# EAGLE design lupa300v3 (EAGLE 8.7.0)
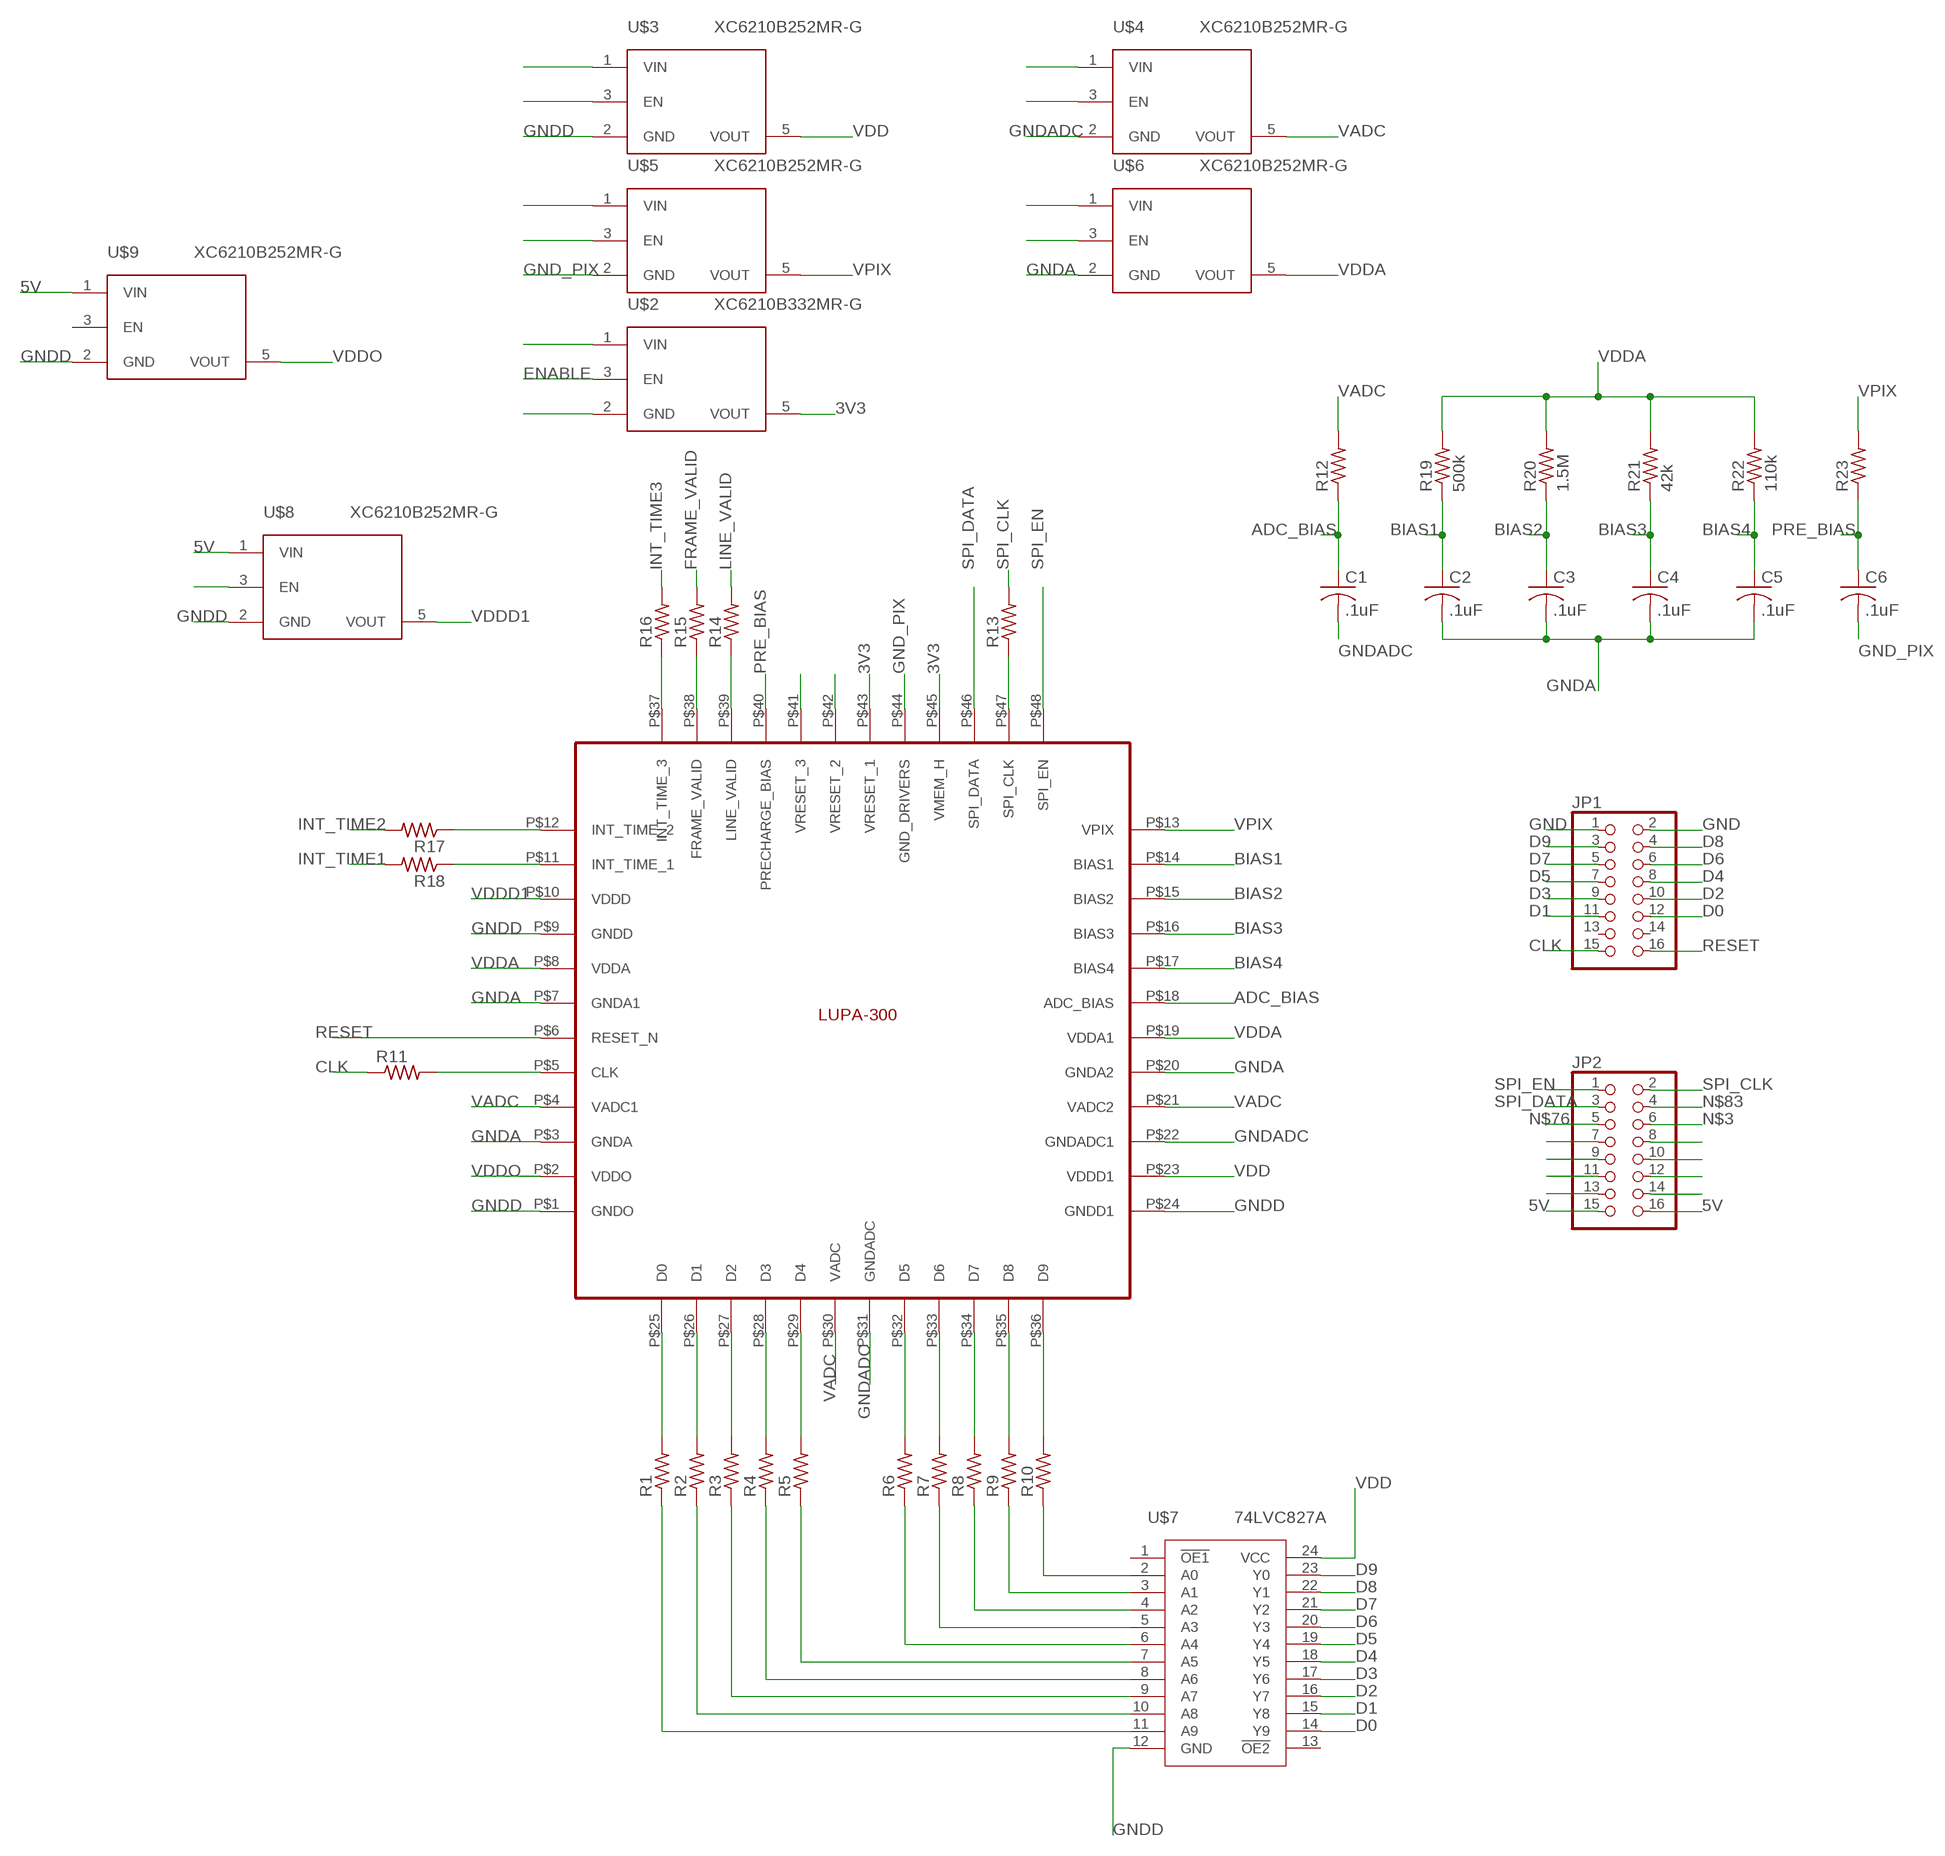
[diagram p0: schematic, sheet 1]

## Parts
C1  .1uF  C-USC0603K  [C0603K]
C2  .1uF  C-USC0603K  [C0603K]
C3  .1uF  C-USC0603K  [C0603K]
C4  .1uF  C-USC0603K  [C0603K]
C5  .1uF  C-USC0603K  [C0603K]
C6  .1uF  C-USC0603K  [C0603K]
JP1  PINHD-2X8  [2X08]
JP2  PINHD-2X8  [2X08]
R1  R-US_R0603  [R0603]
R2  R-US_R0603  [R0603]
R3  R-US_R0603  [R0603]
R4  R-US_R0603  [R0603]
R5  R-US_R0603  [R0603]
R6  R-US_R0603  [R0603]
R7  R-US_R0603  [R0603]
R8  R-US_R0603  [R0603]
R9  R-US_R0603  [R0603]
R10  R-US_R0603  [R0603]
R11  R-US_R0603  [R0603]
R12  R-US_R0603  [R0603]
R13  R-US_R0603  [R0603]
R14  R-US_R0603  [R0603]
R15  R-US_R0603  [R0603]
R16  R-US_R0603  [R0603]
R17  R-US_R0603  [R0603]
R18  R-US_R0603  [R0603]
R19  500k  R-US_R0603  [R0603]
R20  1.5M  R-US_R0603  [R0603]
R21  42k  R-US_R0603  [R0603]
R22  110k  R-US_R0603  [R0603]
R23  R-US_R0603  [R0603]
U$1  LUPA300  [LUPA300]
U$2  XC6210B332MR-G  [SOT25]
U$3  XC6210B252MR-G  [SOT25]
U$4  XC6210B252MR-G  [SOT25]
U$5  XC6210B252MR-G  [SOT25]
U$6  XC6210B252MR-G  [SOT25]
U$7  74LVC827A  [TSSOP24]
U$8  XC6210B252MR-G  [SOT25]
U$9  XC6210B252MR-G  [SOT25]

## Nets
3V3: U$1.P$43(VRESET_1) U$1.P$45(VMEM_H) U$2.5(VOUT)
5V: JP2.15 JP2.16 U$2.1(VIN) U$3.1(VIN) U$4.1(VIN) U$5.1(VIN) U$6.1(VIN) U$8.1(VIN) U$9.1(VIN)
ADC_BIAS: C1.1 R12.1 U$1.P$18(ADC_BIAS)
BIAS1: C2.1 R19.1 U$1.P$14(BIAS1)
BIAS2: C3.1 R20.1 U$1.P$15(BIAS2)
BIAS3: C4.1 R21.1 U$1.P$16(BIAS3)
BIAS4: C5.1 R22.1 U$1.P$17(BIAS4)
CLK: JP1.15 R11.1
D0: JP1.12 U$7.14(Y9)
D1: JP1.11 U$7.15(Y8)
D2: JP1.10 U$7.16(Y7)
D3: JP1.9 U$7.17(Y6)
D4: JP1.8 U$7.18(Y5)
D5: JP1.7 U$7.19(Y4)
D6: JP1.6 U$7.20(Y3)
D7: JP1.5 U$7.21(Y2)
D8: JP1.4 U$7.22(Y1)
D9: JP1.3 U$7.23(Y0)
ENABLE: U$2.3(EN) U$3.3(EN) U$4.3(EN) U$5.3(EN) U$6.3(EN)
FRAME_VALID: R15.2
GND: JP1.1 JP1.2
GND_PIX: C6.2 U$1.P$44(GND_DRIVERS) U$5.2(GND)
GNDA: C2.2 C3.2 C4.2 C5.2 U$1.P$3(GNDA) U$1.P$7(GNDA1) U$1.P$20(GNDA2) U$6.2(GND)
GNDADC: C1.2 U$1.P$22(GNDADC1) U$1.P$31(GNDADC) U$4.2(GND)
GNDD: U$1.P$1(GNDO) U$1.P$9(GNDD) U$1.P$24(GNDD1) U$3.2(GND) U$7.12(GND) U$8.2(GND) U$9.2(GND)
INT1: R18.1 U$1.P$11(INT_TIME_1)
INT2: R17.1 U$1.P$12(INT_TIME_2)
INT_TIME1: R18.2
INT_TIME2: R17.2
INT_TIME3: R16.2
LINE_VALID: R14.2
N$1: R1.2 U$1.P$25(D0)
N$2: R2.2 U$1.P$26(D1)
N$3: JP2.6
N$4: JP2.7
N$5: R3.2 U$1.P$27(D2)
N$6: JP2.8
N$7: JP2.10
N$8: JP2.12
N$9: R4.2 U$1.P$28(D3)
N$10: JP2.14
N$11: JP2.13
N$12: JP2.11
N$13: R5.2 U$1.P$29(D4)
N$14: R6.2 U$1.P$32(D5)
N$15: R7.2 U$1.P$33(D6)
N$16: R8.2 U$1.P$34(D7)
N$17: R9.2 U$1.P$35(D8)
N$18: R10.2 U$1.P$36(D9)
N$19: R11.2 U$1.P$5(CLK)
N$20: JP2.9
N$21: R13.1 U$1.P$47(SPI_CLK)
N$23: R14.1 U$1.P$39(LINE_VALID)
N$24: R15.1 U$1.P$38(FRAME_VALID)
N$25: R16.1 U$1.P$37(INT_TIME_3)
N$26: R10.1 U$7.2(A0)
N$27: U$1.P$41(VRESET_3)
N$28: U$1.P$42(VRESET_2)
N$29: U$2.2(GND)
N$31: R9.1 U$7.3(A1)
N$32: R8.1 U$7.4(A2)
N$33: R7.1 U$7.5(A3)
N$34: R6.1 U$7.6(A4)
N$35: R5.1 U$7.7(A5)
N$36: R4.1 U$7.8(A6)
N$37: R3.1 U$7.9(A7)
N$38: R2.1 U$7.10(A8)
N$39: R1.1 U$7.11(A9)
N$40: U$8.3(EN)
N$76: JP2.5
N$83: JP2.4
PRE_BIAS: C6.1 R23.1 U$1.P$40(PRECHARGE_BIAS)
RESET: JP1.16 U$1.P$6(RESET_N)
SPI_CLK: JP2.2 R13.2
SPI_DATA: JP2.3 U$1.P$46(SPI_DATA)
SPI_EN: JP2.1 U$1.P$48(SPI_EN)
VADC: R12.2 U$1.P$4(VADC1) U$1.P$21(VADC2) U$1.P$30(VADC) U$4.5(VOUT)
VDD: U$1.P$23(VDDD1) U$3.5(VOUT) U$7.24(VCC)
VDDA: R19.2 R20.2 R21.2 R22.2 U$1.P$8(VDDA) U$1.P$19(VDDA1) U$6.5(VOUT)
VDDD1: U$1.P$10(VDDD) U$8.5(VOUT)
VDDO: U$1.P$2(VDDO) U$9.5(VOUT)
VPIX: R23.2 U$1.P$13(VPIX) U$5.5(VOUT)
Unconnected: JP1.13 JP1.14 U$7.1(!OE1) U$7.13(!OE2) U$9.3(EN)

## Library data of the parts
C1-C6 = rcl:C-US: CAPACITOR, American symbol; SPICEPREFIX: C
JP1 JP2 = pinhead:PINHD-2X8: PIN HEADER
R1-R23 = rcl:R-US_: RESISTOR, American symbol; SPICEPREFIX: R
U$1 = andon:LUPA300
U$2 = lupa300-components:XC6210B332MR-G: Linear Voltage Regulator IC Positive Fixed 1 Output 3.3V 700mA SOT-25
U$3-U$6 U$8 U$9 = lupa300-components:XC6210B252MR-G: Linear Voltage Regulator IC Positive Fixed 1 Output 2.5V 700mA SOT-25
U$7 = lupa300-components:74LVC827A: Buffer, Non-Inverting 1 Element 10 Bit per Element Push-Pull Output 24-TSSOP

## Board
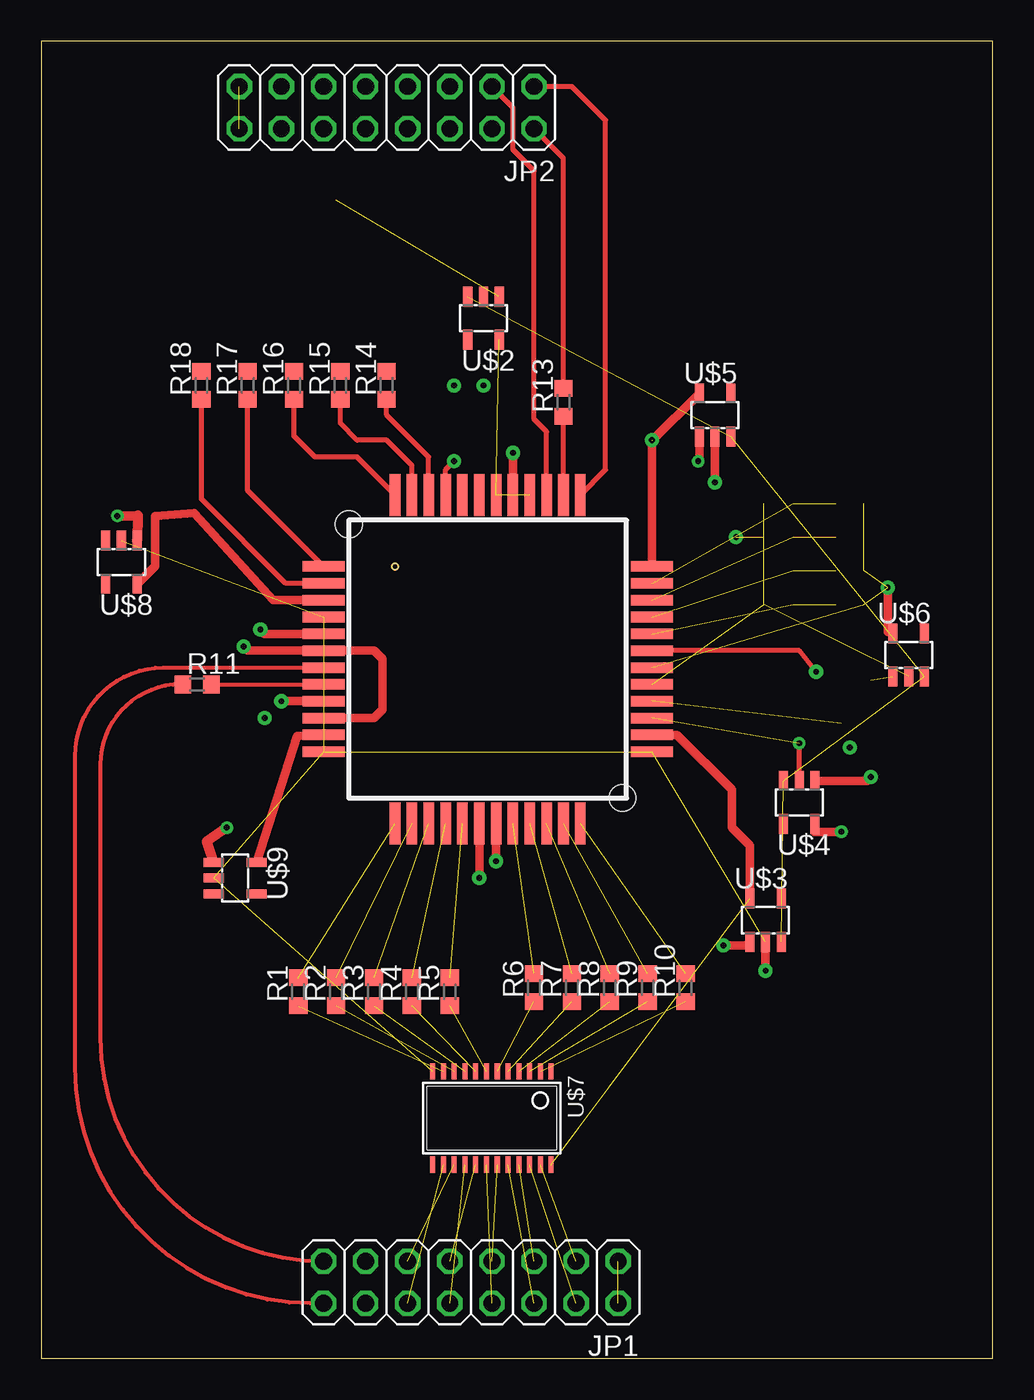
[diagram p1: board, top side]
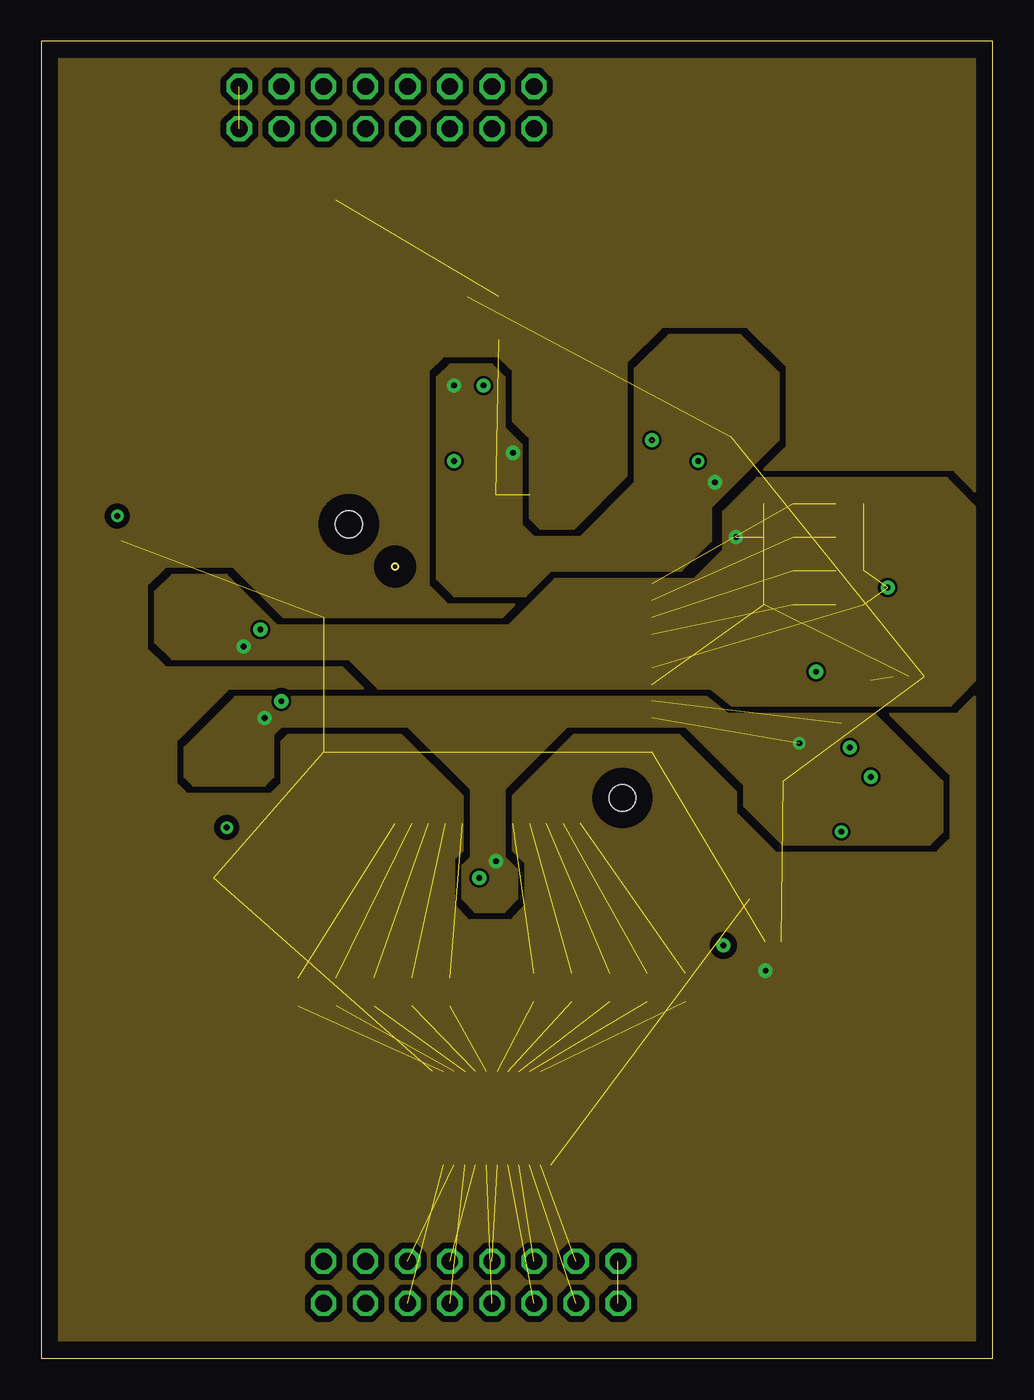
[diagram p2: board, inner layer Route2]
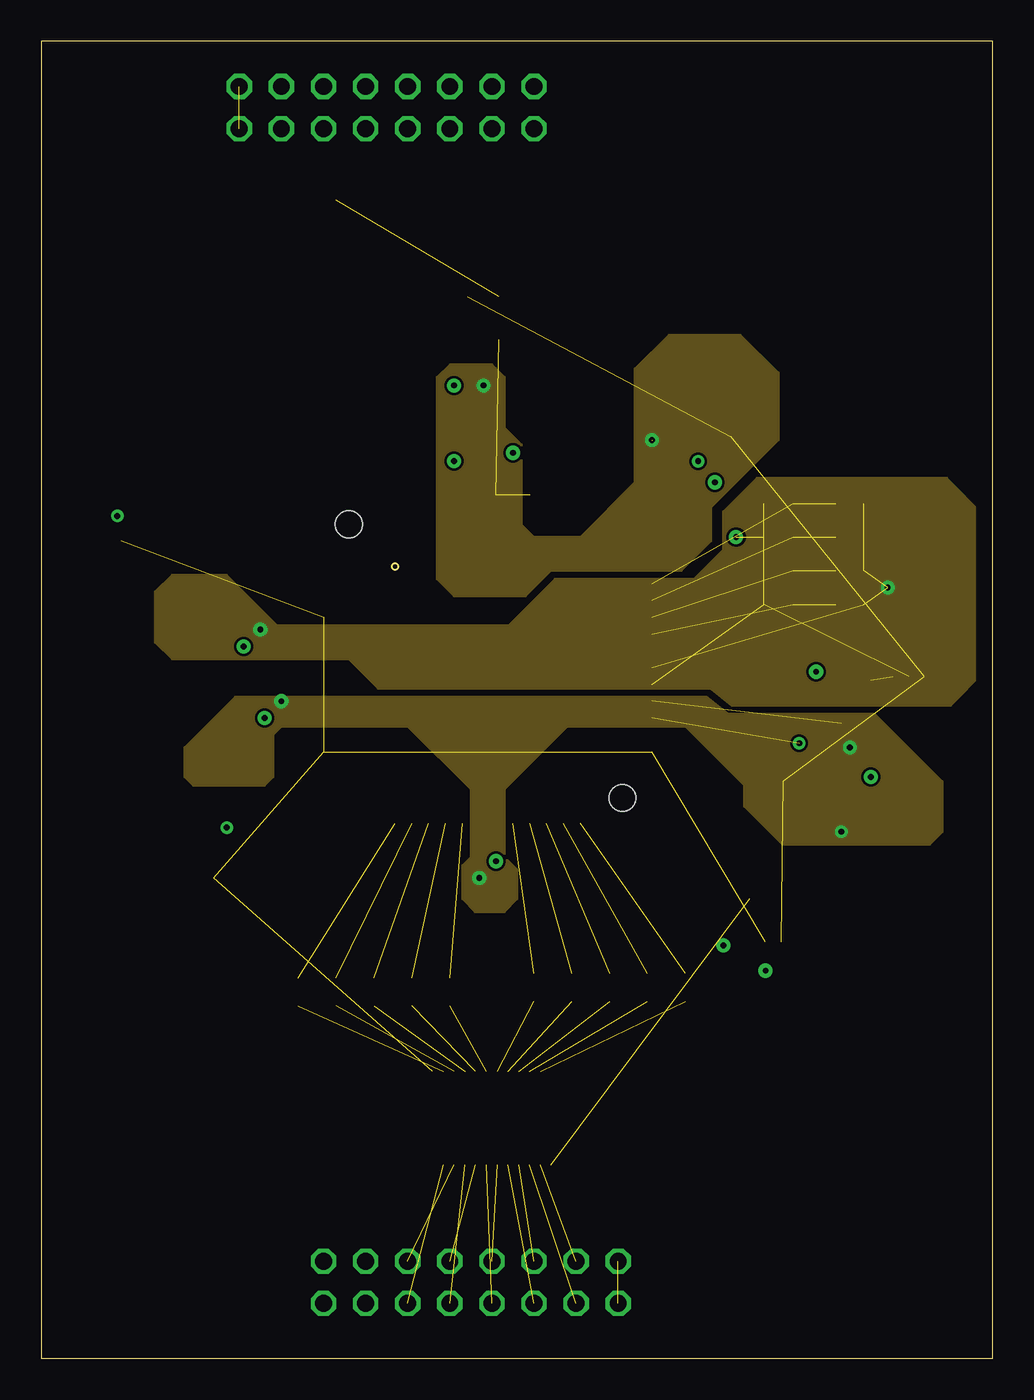
[diagram p3: board, inner layer Route15]
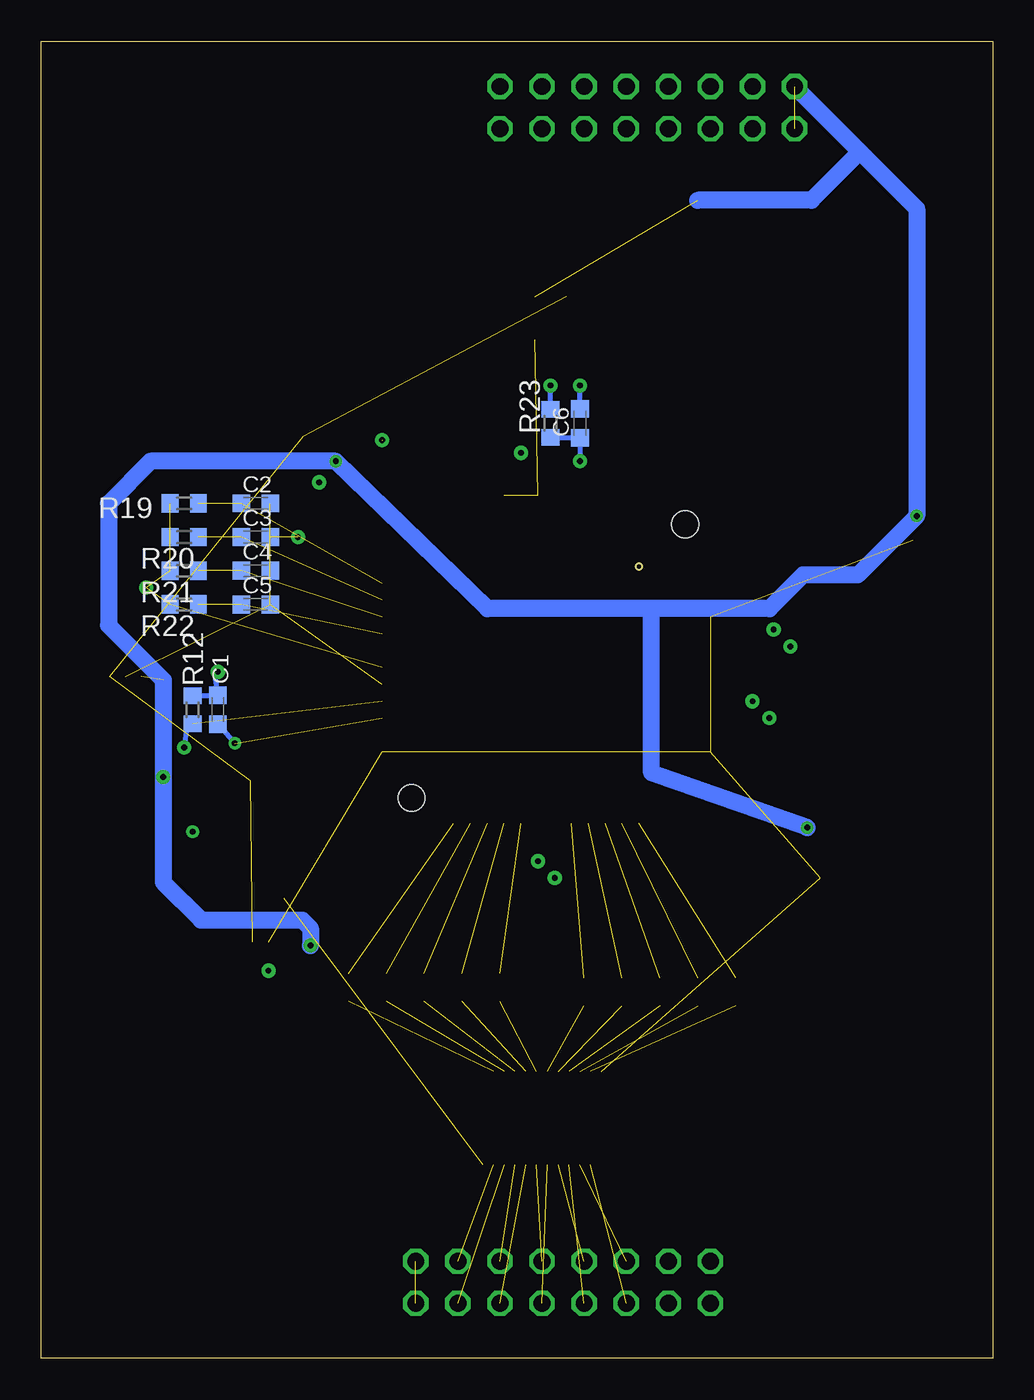
[diagram p4: board, bottom side, seen from below]

Size 57.38 x 79.43 mm. Coordinates in mm from the lower left corner, seen from the top.
Outline: 0,0 57.38,0 57.38,79.43 0,79.43 0,0
Copper layers (1+2*15+16): Top 0.035mm / dielectric 1.5mm / Route2 0.035mm / dielectric 0.15mm / Route15 0.035mm / dielectric 0.2mm / Bottom 0.035mm
Design rules "default *": minimum track width 6mil, minimum drill 0.35mm, track to track 6mil, track to pad 6mil, pad to pad 6mil, via to via 6mil, smd to smd 6mil, copper to edge 40mil, drill to drill 6mil, minimum pad ring 10mil, minimum via ring 8mil, stop-mask expansion 4mil, vias tented up to drill 0mil, thermal gap 10mil

### Footprints (pad centres in the part's own frame; a part is rotated, then mirrored left to right if it is on the bottom)
C0603K = smd 1.05 x 1.08: 1 -0.875,0; 2 0.875,0
2X08 = drill 1.016 octagon: 1 -8.89,-1.27; 2 -8.89,1.27; 3 -6.35,-1.27; 4 -6.35,1.27; 5 -3.81,-1.27; 6 -3.81,1.27; 7 -1.27,-1.27; 8 -1.27,1.27; 9 1.27,-1.27; 10 1.27,1.27; 11 3.81,-1.27; 12 3.81,1.27; 13 6.35,-1.27; 14 6.35,1.27; 15 8.89,-1.27; 16 8.89,1.27
R0603 = smd 1 x 1.1: 1 -0.85,0; 2 0.85,0
LUPA300 = smd 2.54 x 0.635: P$1 -2.794,1.524; P$2 -2.794,2.54; P$3 -2.794,3.556; P$4 -2.794,4.572; P$5 -2.794,5.588; P$6 -2.794,6.604; P$7 -2.794,7.62; P$8 -2.794,8.636; P$9 -2.794,9.652; P$10 -2.794,10.668; P$11 -2.794,11.684; P$12 -2.794,12.7; P$13 17.018,12.7; P$14 17.018,11.684; P$15 17.018,10.668; P$16 17.018,9.652; P$17 17.018,8.636; P$18 17.018,7.62; P$19 17.018,6.604; P$20 17.018,5.588; P$21 17.018,4.572; P$22 17.018,3.556; P$23 17.018,2.54; P$24 17.018,1.524 | smd 0.635 x 2.54: P$25 1.524,-2.794; P$26 2.54,-2.794; P$27 3.556,-2.794; P$28 4.572,-2.794; P$29 5.588,-2.794; P$30 6.604,-2.794; P$31 7.62,-2.794; P$32 8.636,-2.794; P$33 9.652,-2.794; P$34 10.668,-2.794; P$35 11.684,-2.794; P$36 12.7,-2.794; P$37 1.524,17.018; P$38 2.54,17.018; P$39 3.556,17.018; P$40 4.572,17.018; P$41 5.588,17.018; P$42 6.604,17.018; P$43 7.62,17.018; P$44 8.636,17.018; P$45 9.652,17.018; P$46 10.668,17.018; P$47 11.684,17.018; P$48 12.7,17.018 | hole 1.6: -1.27,15.24; 15.24,-1.27
SOT25 = smd 0.55 x 1.2: 1 -0.95,-1.3; 2 0,-1.3; 3 0.95,-1.3; 4 0.95,1.3; 5 -0.95,1.3
TSSOP24 = smd 0.305 x 0.991: 1 -3.575,-2.818; 2 -2.925,-2.818; 3 -2.275,-2.818; 4 -1.625,-2.818; 5 -0.975,-2.818; 6 -0.325,-2.818; 7 0.325,-2.818; 8 0.975,-2.818; 9 1.625,-2.818; 10 2.275,-2.818; 11 2.925,-2.818; 12 3.575,-2.818; 13 3.575,2.818; 14 2.925,2.818; 15 2.275,2.818; 16 1.625,2.818; 17 0.975,2.818; 18 0.325,2.818; 19 -0.325,2.818; 20 -0.975,2.818; 21 -1.625,2.818; 22 -2.275,2.818; 23 -2.925,2.818; 24 -3.575,2.818

### Placement (x,y rotation side)
C1  46.74,39.12 270 bottom
C2  44.45,51.56 0 bottom
C3  44.45,49.53 0 bottom
C4  44.45,47.5 0 bottom
C5  44.45,45.47 0 bottom
C6  24.89,56.39 90 bottom
JP1  25.91,4.57 180 top
JP2  20.83,75.44 180 top
R1  15.49,22.1 90 top
R2  17.78,22.1 90 top
R3  20.07,22.1 90 top
R4  22.35,22.1 90 top
R5  24.64,22.1 90 top
R6  29.72,22.35 90 top
R7  32,22.35 90 top
R8  34.29,22.35 90 top
R9  36.58,22.35 90 top
R10  38.86,22.35 90 top
R11  9.4,40.64 0 top
R12  48.26,39.12 270 bottom
R13  31.5,57.66 90 top
R14  20.83,58.67 90 top
R15  18.03,58.67 90 top
R16  15.24,58.67 90 top
R17  12.45,58.67 90 top
R18  9.65,58.67 90 top
R19  48.77,51.56 180 bottom
R20  48.77,49.53 180 bottom
R21  48.77,47.5 180 bottom
R22  48.77,45.47 180 bottom
R23  26.67,56.39 90 bottom
U$1  19.81,35.05 0 top
U$2  26.67,62.74 180 top
U$3  43.69,26.42 0 top
U$4  45.72,33.53 180 top
U$5  40.64,56.9 0 top
U$6  52.32,42.42 0 top
U$7  27.18,14.48 180 top
U$8  4.83,48.01 180 top
U$9  11.68,28.96 270 top

### Tracks (layer width: path | path; a pad name or v marks a point on that pad's centre or on a via)
3V3  (2 unrouted)
5V  (via drill 0.35, 0.35 pad 0.85)  (3 unrouted)
  Top 0.508: U$4.1 49.81,34.83 v50.04,35.05 | U$5.1 39.69,54.17 v39.62,54.1 | v41.15,24.89 42.51,24.89 U$3.1
  Top 0.61: v4.57,50.8 5.81,50.83 U$8.1 | v11.18,32 9.97,31.18 U$9.1
  Bottom 1.016: JP2.15 8,72.77 | 8,72.77 4.57,69.34 v4.57,50.8 8.13,47.24 11.43,47.24 13.46,45.21 20.32,45.21 | v11.18,32 20.57,35.31 20.57,44.96 20.32,45.21 | 20.32,45.21 30.48,45.21 v39.62,54.1 50.8,54.1 53.34,51.56 53.34,44.2 50.04,40.89 v50.04,35.05 50.04,28.7 47.75,26.42 41.66,26.42 41.15,25.91 v41.15,24.89 | 8,72.77 10.92,69.85 17.78,69.85
ADC_BIAS  (via drill 0.35 pad 0.85)
  Top 0.305: v46.74,41.4 45.72,42.67 U$1.P$18
  Bottom 0.305: R12.1 46.51,39.97 C1.1 46.88,41.01 v46.74,41.4
BIAS1  (2 unrouted)
BIAS2  (2 unrouted)
BIAS3  (2 unrouted)
BIAS4  (2 unrouted)
CLK
  Top 0.254: R11.1 8.38,40.64 arc90 3.56,35.81 3.56,19.3 arc90 JP1.15
D0  (1 unrouted)
D1  (1 unrouted)
D2  (1 unrouted)
D3  (1 unrouted)
D4  (1 unrouted)
D5  (1 unrouted)
D6  (1 unrouted)
D7  (1 unrouted)
D8  (1 unrouted)
D9  (1 unrouted)
ENABLE  (4 unrouted)
GND  (1 unrouted)
GND_PIX  (via drill 0.35 pad 0.85)
  Top 0.508: v40.64,52.83 U$5.2 | v28.45,54.61 U$1.P$44
  Bottom 0.305: C6.2 v24.89,58.67
  pour Route2: 23.88,59.18 23.88,46.99 24.89,45.97 29.21,45.97 30.73,47.5 38.61,47.5 40.39,49.28 40.39,51.31 44.45,55.37 44.45,59.44 42.16,61.72 37.85,61.72 35.81,59.69 35.81,52.83 32.51,49.53 29.72,49.53 28.96,50.29 28.96,55.12 27.94,56.13 27.94,59.18 27.18,59.94 24.64,59.94
GNDA  (via drill 0.35 pad 0.85)  (6 unrouted)
  Top 0.508: v12.19,42.93 12.45,42.67 U$1.P$7 20.07,42.67 20.57,42.16 20.57,39.12 20.07,38.61 U$1.P$3
  other vias: 41.91,49.53
  pour Route2: 7.87,42.16 18.54,42.16 20.32,40.39 40.39,40.39 41.66,39.37 54.86,39.37 56.9,41.4 56.9,50.8 54.61,53.09 43.18,53.09 41.15,51.05 41.15,48.77 39.37,46.99 30.99,46.99 28.19,44.2 14.22,44.2 11.18,47.24 7.87,47.24 6.86,46.23 6.86,43.18
GNDADC  (via drill 0.35, 0.35 pad 0.85)  (1 unrouted)
  Top 0.305: U$4.2 v45.72,37.08
  Top 0.508: v27.43,29.97 U$1.P$31
  Bottom 0.305: C1.2 v45.72,37.08
  other vias: 13.46,38.61
  pour Route2: 25.91,30.23 25.91,34.29 22.1,38.1 14.48,38.1 13.97,37.59 13.97,35.05 13.46,34.54 9.14,34.54 8.64,35.05 8.64,36.83 11.68,39.88 40.13,39.88 41.4,38.86 50.29,38.86 54.36,34.8 54.36,31.75 53.59,30.99 44.7,30.99 42.42,33.27 42.42,34.54 38.86,38.1 31.75,38.1 27.94,34.29 27.94,30.23 28.7,29.46 28.7,27.69 27.94,26.92 26.16,26.92 25.4,27.69 25.4,29.72
GNDD  (via drill 0.35 pad 0.85)  (6 unrouted)
  Top 0.508: v43.69,23.37 U$3.2
  pour Route2 (isolate 0.381, rank 2): 0,78.99 57.15,78.99 57.15,0 0.25,0 0,-0.25
INT1
  Top 0.305: U$1.P$11 14.73,46.74 9.65,51.82 R18.1
INT2
  Top 0.305: U$1.P$12 12.45,52.32 R17.1
N$1  (1 unrouted)
N$2  (1 unrouted)
N$5  (1 unrouted)
N$9  (1 unrouted)
N$13  (1 unrouted)
N$14  (1 unrouted)
N$15  (1 unrouted)
N$16  (1 unrouted)
N$17  (1 unrouted)
N$18  (1 unrouted)
N$19
  Top 0.254: R11.2 U$1.P$5
N$21
  Top 0.305: U$1.P$47 R13.1
N$23
  Top 0.305: U$1.P$39 23.37,54.36 20.83,56.9 R14.1
N$24
  Top 0.305: U$1.P$38 22.35,53.85 20.83,55.37 19.05,55.37 18.03,56.39 R15.1
N$25
  Top 0.305: U$1.P$37 19.05,54.36 16.51,54.36 15.24,55.63 R16.1
N$26  (1 unrouted)
N$31  (1 unrouted)
N$32  (1 unrouted)
N$33  (1 unrouted)
N$34  (1 unrouted)
N$35  (1 unrouted)
N$36  (1 unrouted)
N$37  (1 unrouted)
N$38  (1 unrouted)
N$39  (1 unrouted)
PRE_BIAS  (via drill 0.35 pad 0.85)
  Top 0.305: U$1.P$40 24.38,53.59 v24.89,54.1
  Bottom 0.305: R23.1 26.64,55.51 C6.1 v24.89,54.1
RESET
  Top 0.254: JP1.16 16.26,3.3 arc-90 2.03,17.53 2.03,36.32 arc-90 7.37,41.66 U$1.P$6
SPI_CLK
  Top 0.305: R13.2 31.5,72.39 JP2.2
SPI_DATA
  Top 0.305: U$1.P$46 30.48,55.88 29.72,56.64 29.72,71.63 28.45,72.9 28.45,75.44 JP2.3
SPI_EN
  Top 0.305: U$1.P$48 34.04,53.59 34.04,74.68 32,76.71 JP2.1
VADC  (via drill 0.35, 0.35 pad 0.85)  (1 unrouted)
  Top 0.508: U$4.5 46.64,31.75 v48.26,31.75 | v14.48,39.62 U$1.P$4 | U$1.P$30 v26.42,28.96
  Bottom 0.305: R12.2 48.6,38.27 v48.77,36.83
  pour Route15: 25.91,30.23 25.91,34.29 22.1,38.1 14.48,38.1 13.97,37.59 13.97,35.05 13.46,34.54 9.14,34.54 8.64,35.05 8.64,36.83 11.68,39.88 40.13,39.88 41.4,38.86 50.29,38.86 54.36,34.8 54.36,31.75 53.59,30.99 44.7,30.99 42.42,33.27 42.42,34.54 38.86,38.1 31.75,38.1 27.94,34.29 27.94,30.23 28.7,29.46 28.7,27.69 27.94,26.92 26.16,26.92 25.4,27.69 25.4,29.72
VDD  (1 unrouted)
  Top 0.508: U$3.5 42.74,30.92 41.66,32 41.66,34.29 38.35,37.59 U$1.P$23
VDDA  (via drill 0.35 pad 0.85)  (5 unrouted)
  Top 0.508: U$1.P$8 13.46,43.69 v13.21,43.94 | U$6.5 51.05,43.78 v51.05,46.48
  pour Route15: 7.87,42.16 18.54,42.16 20.32,40.39 40.39,40.39 41.66,39.37 54.86,39.37 56.9,41.4 56.9,50.8 54.61,53.09 43.18,53.09 41.15,51.05 41.15,48.77 39.37,46.99 30.99,46.99 28.19,44.2 14.22,44.2 11.18,47.24 7.87,47.24 6.86,46.23 6.86,43.18
VDDD1
  Top 0.508: U$8.5 6.86,47.79 6.86,50.8 9.21,50.99 13.97,45.72 U$1.P$10
VDDO
  Top 0.508: U$9.5 15.43,37.53 U$1.P$2
VPIX  (via drill 0.35 pad 0.85)  (1 unrouted)
  Top 0.508: U$5.5 36.83,55.34 U$1.P$13
  Bottom 0.305: R23.2 v26.67,58.67
  other vias: 36.83,55.37
  pour Route15: 23.88,59.18 23.88,46.99 24.89,45.97 29.21,45.97 30.73,47.5 38.61,47.5 40.39,49.28 40.39,51.31 44.45,55.37 44.45,59.44 42.16,61.72 37.85,61.72 35.81,59.69 35.81,52.83 32.51,49.53 29.72,49.53 28.96,50.29 28.96,55.12 27.94,56.13 27.94,59.18 27.18,59.94 24.64,59.94